# EAGLE design TAG_connect (EAGLE 6.3)
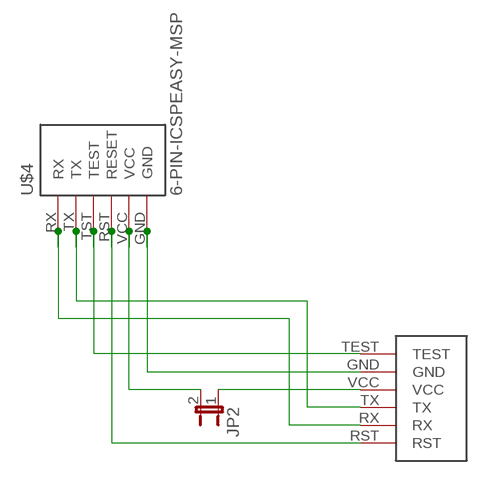
[diagram p0: schematic, sheet 1]

## Parts
JP2  JUMPER-2PTH_LOCK  [1X02_LOCK]
U$1  RJ-45SMD  [MOLEX_RJ45_SMD]
U$4  6-PIN-ICSPEASY-MSP  [EASYMSP-6PIN]

## Nets
GND: U$1.GND U$4.GND
RST: U$1.RST U$4.RST(RESET)
RX: U$1.RX U$4.RX
TEST: U$1.TEST U$4.TST(TEST)
TX: U$1.TX U$4.TX
VCC_FET: JP2.2 U$4.VCC
VCC_TARGET: JP2.1 U$1.VCC

## Library data of the parts
JP2 = SparkFun-Passives:JUMPER-2: Jumper Basic 0.1" spaced jumper. Use with breakaway headers.
U$1 = LaunchFET:RJ-45; MODEL: 95501-6669
U$4 = LaunchFET:6-PIN-ICSP: 6 pin easy-msp formatted headers. Designed to make programming target boards with MSP430 Launchpad easier. EASYMSP: standard .05" pitch header to match launchpad SAFEMSP: .05" header with .025" offset Vcc to keep Geordi away

## Board
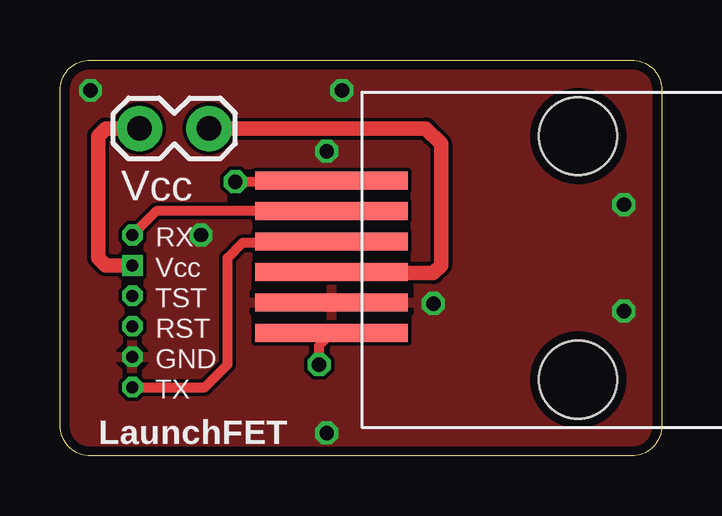
[diagram p1: board, top side]
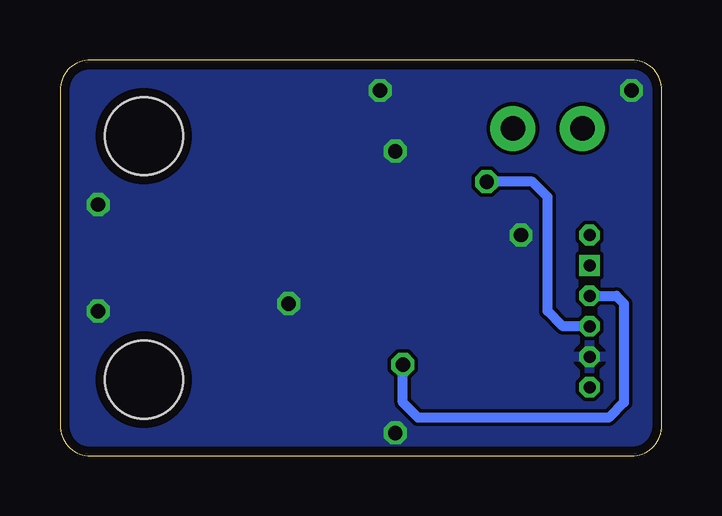
[diagram p2: board, bottom side, seen from below]

Size 25.08 x 16.51 mm. Coordinates in mm from the lower left corner, seen from the top.
Outline: 1.27,16.51 23.81,16.51 arc-90 25.08,15.24 25.08,1.27 arc-90 23.81,0 1.27,0 arc-90 0,1.27 0,15.24 arc-90 1.27,16.51
Copper layers (1*16): Top 0.0356mm / dielectric 1.5011mm / Bottom 0.0356mm
Design rules "LaenPCBOrder *": minimum track width 6mil, minimum drill 13mil, track to track 6mil, track to pad 6mil, pad to pad 6mil, via to via 6mil, smd to smd 6mil, copper to edge 15mil, drill to drill 6mil, minimum pad ring 7mil, minimum via ring 7mil, stop-mask expansion 4mil, vias tented up to drill 20mil, thermal gap 10mil

### Footprints (pad centres in the part's own frame; a part is rotated, then mirrored left to right if it is on the bottom)
1X02_LOCK = drill 1.016 pad 1.88: 1 -0.178,0; 2 2.718,0
MOLEX_RJ45_SMD = smd 0.76 x 6.35: GND 3.22,10.27; RST 8.3,10.27; RX 7.03,10.27; TEST 1.95,10.27; TX 5.76,10.27; VCC 4.49,10.27 | hole 3.25: 0,0; 10.16,0
EASYMSP-6PIN = drill 0.5 octagon: GND 0,-1.27; RST 0,0; RX 0,3.81; TST 0,1.27; TX 0,-2.54 | drill 0.5 square: VCC 0,2.54

### Placement (x,y rotation side)
JP2  6.03,13.65 180 top
U$1  21.59,3.18 90 top
U$4  3.02,5.4 0 top

### Tracks (layer width: path | path; a pad name or v marks a point on that pad's centre or on a via)
GND  (via drill 0.6)
  other vias: 1.27,15.24 11.75,15.24 11.11,0.95 23.49,10.48 23.49,6.03 11.11,12.7 5.87,9.21 15.56,6.35
  pour Top: 0,16.51 25.08,16.51 25.08,0 0,0
  pour Bottom: 0,16.51 25.08,16.51 25.08,0 0,0
RST  (via drill 0.6)
  Top 0.406: v7.3,11.43 11.27,11.43 U$1.RST
  Bottom 0.406: U$4.RST 4.13,5.4 4.76,6.03 4.76,10.79 5.4,11.43 v7.3,11.43
RX
  Top 0.406: U$1.RX 4.01,10.21 U$4.RX
TEST  (via drill 0.6)
  Top 0.406: v10.8,3.81 10.8,4.6 U$1.TEST
  Bottom 0.406: U$4.TST 1.91,6.67 1.59,6.35 1.59,2.22 2.22,1.59 10.16,1.59 10.8,2.22 v10.8,3.81
TX
  Top 0.406: U$4.TX 6.03,2.86 6.98,3.81 6.98,8.25 7.62,8.89 11.27,8.89 U$1.TX
VCC_FET
  Top 0.61: U$4.VCC 1.91,7.94 1.59,8.25 1.59,13.33 1.91,13.65 JP2.2
VCC_TARGET
  Top 0.406: 11.37,7.62 U$1.VCC
  Top 0.61: JP2.1 15.24,13.65 15.87,13.02 15.87,7.94 15.56,7.62 11.37,7.62

### Text on the board
bStop: github/launchFET
_tsilk: Vcc | LaunchFET